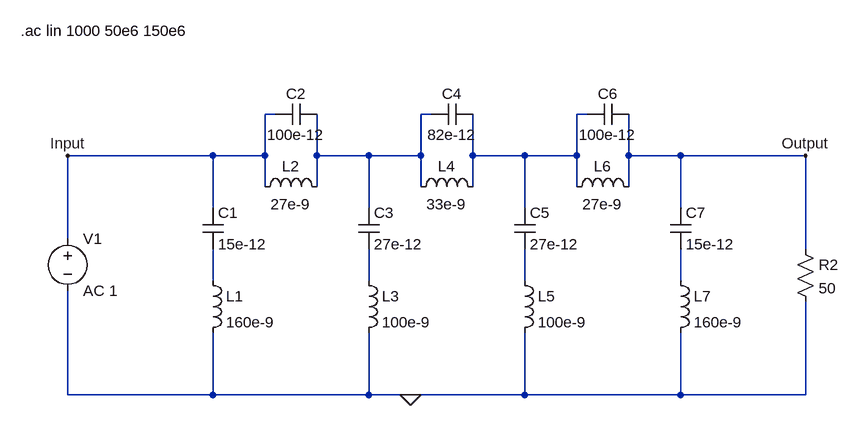
[diagram p0: schematic 3 Pole Filter.asc]
3 Pole Filter.asc, the LTspice schematic file:
Version 4
SHEET 1 1528 680
WIRE 256 48 240 48
WIRE 496 48 480 48
WIRE 736 48 720 48
WIRE 160 112 -64 112
WIRE 240 112 240 48
WIRE 240 112 160 112
WIRE 320 112 320 48
WIRE 400 112 320 112
WIRE 480 112 480 48
WIRE 480 112 400 112
WIRE 560 112 560 48
WIRE 640 112 560 112
WIRE 720 112 720 48
WIRE 720 112 640 112
WIRE 800 112 800 48
WIRE 880 112 800 112
WIRE 1072 112 880 112
WIRE 240 160 240 112
WIRE 320 160 320 112
WIRE 480 160 480 112
WIRE 560 160 560 112
WIRE 720 160 720 112
WIRE 800 160 800 112
WIRE 160 192 160 112
WIRE 400 192 400 112
WIRE 640 192 640 112
WIRE 880 192 880 112
WIRE -64 240 -64 112
WIRE 1072 256 1072 112
WIRE 160 304 160 256
WIRE 400 304 400 256
WIRE 640 304 640 256
WIRE 880 304 880 256
WIRE -64 480 -64 320
WIRE 160 480 160 384
WIRE 160 480 -64 480
WIRE 400 480 400 384
WIRE 400 480 160 480
WIRE 464 480 400 480
WIRE 640 480 640 384
WIRE 640 480 464 480
WIRE 880 480 880 384
WIRE 880 480 640 480
WIRE 1072 480 1072 336
WIRE 1072 480 880 480
FLAG 1072 112 Output
FLAG -64 112 Input
FLAG 464 480 0
SYMBOL cap 144 192 R0
SYMATTR InstName C1
SYMATTR Value 15e-12
SYMBOL cap 320 32 R90
WINDOW 0 0 32 VBottom 2
WINDOW 3 32 32 VTop 2
SYMATTR InstName C2
SYMATTR Value 100e-12
SYMBOL ind 144 288 R0
SYMATTR InstName L1
SYMATTR Value 160e-9
SYMBOL ind 224 176 R270
WINDOW 0 32 56 VTop 2
WINDOW 3 5 56 VBottom 2
SYMATTR InstName L2
SYMATTR Value 27e-9
SYMBOL cap 384 192 R0
SYMATTR InstName C3
SYMATTR Value 27e-12
SYMBOL cap 560 32 R90
WINDOW 0 0 32 VBottom 2
WINDOW 3 32 32 VTop 2
SYMATTR InstName C4
SYMATTR Value 82e-12
SYMBOL ind 384 288 R0
SYMATTR InstName L3
SYMATTR Value 100e-9
SYMBOL ind 464 176 R270
WINDOW 0 32 56 VTop 2
WINDOW 3 5 56 VBottom 2
SYMATTR InstName L4
SYMATTR Value 33e-9
SYMBOL cap 624 192 R0
SYMATTR InstName C5
SYMATTR Value 27e-12
SYMBOL cap 800 32 R90
WINDOW 0 0 32 VBottom 2
WINDOW 3 32 32 VTop 2
SYMATTR InstName C6
SYMATTR Value 100e-12
SYMBOL ind 624 288 R0
SYMATTR InstName L5
SYMATTR Value 100e-9
SYMBOL ind 704 176 R270
WINDOW 0 32 56 VTop 2
WINDOW 3 5 56 VBottom 2
SYMATTR InstName L6
SYMATTR Value 27e-9
SYMBOL cap 864 192 R0
SYMATTR InstName C7
SYMATTR Value 15e-12
SYMBOL ind 864 288 R0
SYMATTR InstName L7
SYMATTR Value 160e-9
SYMBOL res 1056 240 R0
SYMATTR InstName R2
SYMATTR Value 50
SYMBOL voltage -64 224 R0
WINDOW 123 0 0 Left 0
WINDOW 39 0 0 Left 0
SYMATTR InstName V1
SYMATTR Value AC 1
TEXT -136 -80 Left 2 !.ac lin 1000 50e6 150e6

The netlist it stands for:
* 3 Pole Filter.asc
C1 Input N003 15e-12
C2 N001 Input 100e-12
L1 N003 0 160e-9
L2 Input N001 27e-9
C3 N001 N004 27e-12
C4 N002 N001 82e-12
L3 N004 0 100e-9
L4 N001 N002 33e-9
C5 N002 N005 27e-12
C6 Output N002 100e-12
L5 N005 0 100e-9
L6 N002 Output 27e-9
C7 Output N006 15e-12
L7 N006 0 160e-9
R2 Output 0 50
V1 Input 0 AC 1
.ac lin 1000 50e6 150e6
.backanno
.end